# EAGLE design CurrentCost (EAGLE 7.4.0)
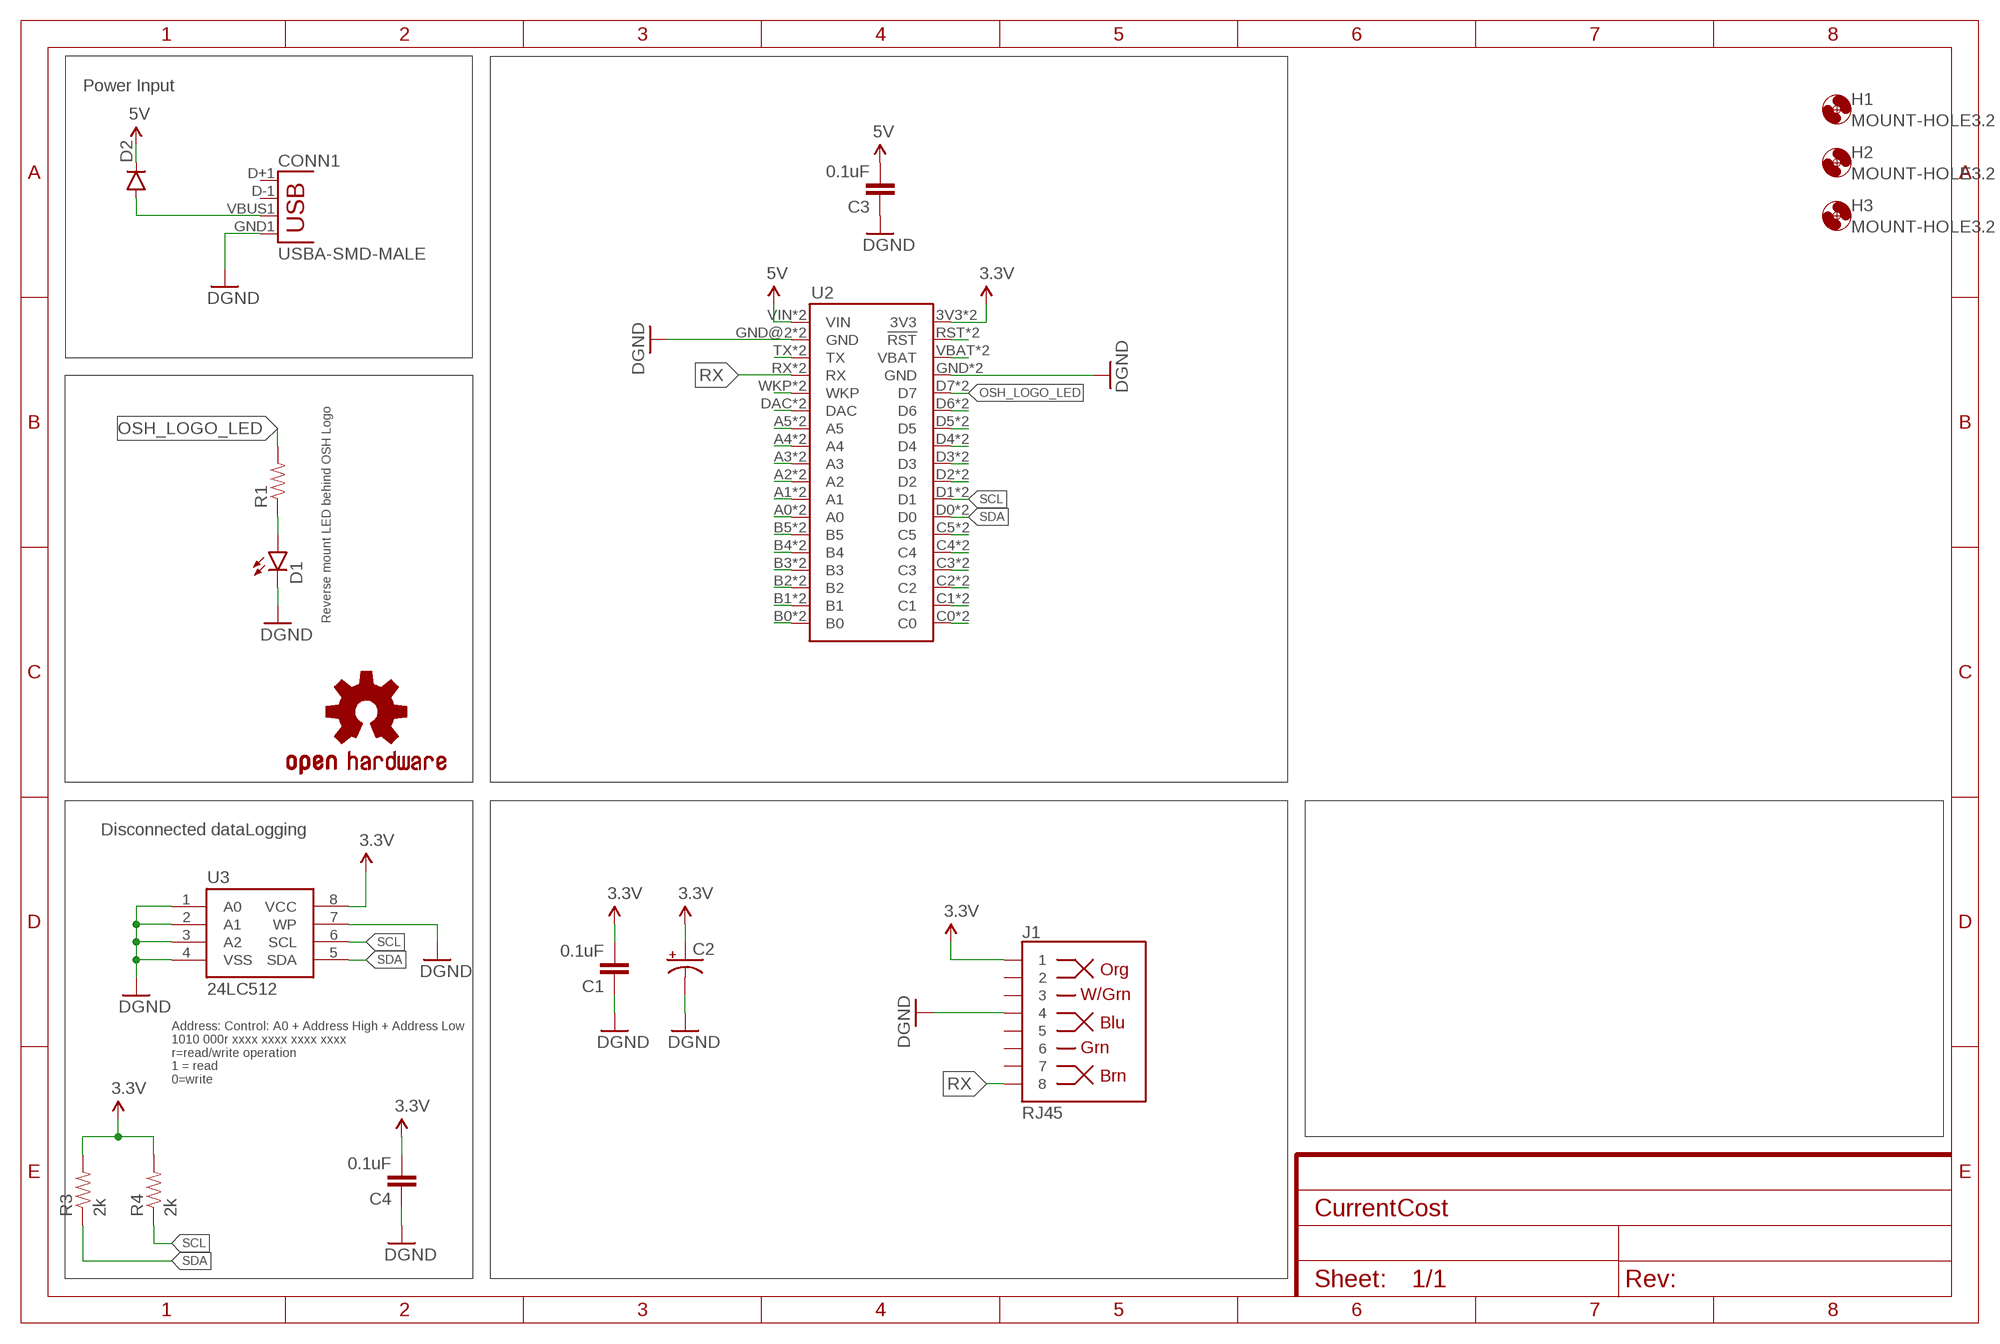
[diagram p0: schematic, sheet 1]

## Parts
C1  0.1uF  CAP0805  [0805]
C2  CAP_POLPTH1  [CPOL-RADIAL-100UF-25V]
C3  0.1uF  CAP0805  [0805]
C4  0.1uF  CAP0805  [0805]
CONN1  USBA-SMD-MALE  [USB-A-SMT-MALE]
D1  LED1206-BOTTOM  [LED-1206-BOTTOM]
D2  DIODESMA  [SMA-DIODE]
H1  MOUNT-HOLE3.2  [3,2]
H2  MOUNT-HOLE3.2  [3,2]
H3  MOUNT-HOLE3.2  [3,2]
J1  RJ45  RJ45-8PTH  [RJ45-8]
LOGO1  OSHW-LOGOM  [OSHW-LOGO-M]
R1  RESISTOR1206  [1206]
R3  2k  RESISTOR0805-RES  [0805]
R4  2k  RESISTOR0805-RES  [0805]
U2  ELECTRONDUALNAMED  [ELECTRON_SIMPLE_SILK_NAMES_DUAL]
U3  24LC512  EEPROM-I2CSMD  [SO08]

## Nets
3.3V: C1.2 C2.1(+) C4.2 J1.1 R3.2 R4.2 U2.3V3 U2.3V3_1(3V3) U3.8(VCC)
5V: C3.2 D2.C U2.VIN U2.VIN_1B(VIN)
DQ: U2.A0 U2.A0_1(A0)
GND: C1.1 C2.2(-) C3.1 C4.1 CONN1.GND1(GND) D1.C J1.4 U2.GND U2.GND@2(GND) U2.GND_1(GND) U2.GND_1B(GND) U3.1(A0) U3.2(A1) U3.3(A2) U3.4(VSS) U3.7(WP) ; supply symbol labelled DGND
MISO: U2.A4 U2.A4_1(A4)
MOSI: U2.A5 U2.A5_1(A5)
N$1: CONN1.VBUS1(VBUS) D2.A
N$3: U2.A1 U2.A1_1(A1)
N$4: U2.D2 U2.D2_1(D2)
N$6: U2.VBAT U2.VBATT_1(VBAT)
N$7: U2.RST(!RST) U2.RST_1(!RST)
N$12: U2.D3 U2.D3_1(D3)
N$15: U2.D6 U2.D6_1(D6)
N$16: U2.D5 U2.D5_1(D5)
N$21: D1.A R1.1
N$22: U2.C1 U2.C1_1(C1)
N$23: U2.C5 U2.C5_1(C5)
N$24: U2.C4 U2.C4_1(C4)
N$25: U2.C3 U2.C3_1(C3)
N$26: U2.C2 U2.C2_1(C2)
N$27: U2.C0 U2.C0_1(C0)
N$28: U2.D4 U2.D4_1(D4)
N$31: U2.B0 U2.B0_1(B0)
N$33: U2.B1 U2.B1_1(B1)
N$35: U2.B2 U2.B2_1(B2)
N$36: U2.B3 U2.B3_1(B3)
N$37: U2.B4 U2.B4_1(B4)
N$38: U2.B5 U2.B5_1(B5)
N$46: U2.WKP U2.WKP_1(WKP)
N$48: U2.TX U2.TX_1(TX)
OSH_LOGO_LED: R1.2 U2.D7 U2.D7_1(D7)
RX: J1.8 U2.RX U2.RX_1(RX)
SCK: U2.A3 U2.A3_1(A3)
SCL: R4.1 U2.D1 U2.D1_1(D1) U3.6(SCL)
SDA: R3.1 U2.D0 U2.D0_1(D0) U3.5(SDA)
SS: U2.A2 U2.A2_1(A2)
VIN_MONITOR: U2.DAC U2.DAC_1(DAC)
Unconnected: CONN1.D+1(D+) CONN1.D-1(D-) J1.2 J1.3 J1.5 J1.6 J1.7

## Notes on the sheet
- Power Input
- Reverse mount LED behind OSH Logo
- Disconnected dataLogging
- Address: Control: A0 + Address High + Address Low
- 1010 000r xxxx xxxx xxxx xxxx
  r=read/write operation
  1 = read
  0=write

## Library data of the parts
C1 C3 C4 = SparkFun-Passives:CAP: Capacitor Standard 0603 ceramic capacitor, and 0.1" leaded capacitor.
C2 = SparkFun-Capacitors:CAP_POL: Capacitor Polarized These are standard SMD and PTH capacitors. Normally 10uF, 47uF, and 100uF in electrolytic and tantalum varieties. Always verify the external diameter of the through hole cap, it varies with capacity, voltage, and manufacturer. The EIA devices should be standard.
CONN1 = SparkFun-Connectors:USB: USB Connectors USB-B-PTH is fully proven SKU : PRT-00139/CONN-08278 USB-miniB is fully proven SKU : PRT-00587 USB-A-PCB is untested. USB-A-H is throughly reviewed, but untested. Spark Fun Electronics SKU : PRT-00437 USB-B-SMT is throughly reviewed, but untested. Needs silkscreen touching up. USB-A-S has not been used/tested USB-MB-H has not been used/tested USB-MICROB has been used. CONN-09505
D1 = SparkFun-LED:LED: LEDs Standard schematic elements and footprints for 5mm, 3mm, 1206, and 0603 sized LEDs. 5mm - Spark Fun Electronics SKU : COM-00529 (and others)
D2 = SparkFun-DiscreteSemi:DIODE: Diode These are standard reverse protection diodes and small signal diodes. SMA package can handle up to about 1A. SOD-323 can handle about 200mA. What the SOD-323 package when ordering, there are some mfgs out there that are 5-pin packages.
H1-H3 = holes:MOUNT-HOLE: MOUNTING HOLE with drill center marker
J1 = SparkFun-Connectors:RJ45-8: RJ45 Jack Simple RJ45, 8-pin connection - connector for common Cat5, Cat5e, and Cat6 Ethernet cables. Footprint not yet proven in production. Connector sku is PRT-00643; Breakout PCB sku is BOB-00716.; FARNELL: 1524544; PROD_ID: CONN-08506
LOGO1 = SparkFun-Aesthetics:OSHW-LOGO: Open Source Hardware Logo This logo indicates the piece of hardware it is found on incorporates a OSHW license and/or adheres to the definition of open source hardware found here: http://freedomdefined.org/OSHW
R1 R3 R4 = SparkFun-Resistors:RESISTOR: Resistor Basic schematic elements and footprints for 0603, 1206, and PTH resistors.
U2 = Tinamous:ELECTRON
U3 = SparkFun-DigitalIC:EEPROM-I2C: I2C EEPROM chips, 24LC256 (and others); FARNELL: 1801220

## Board
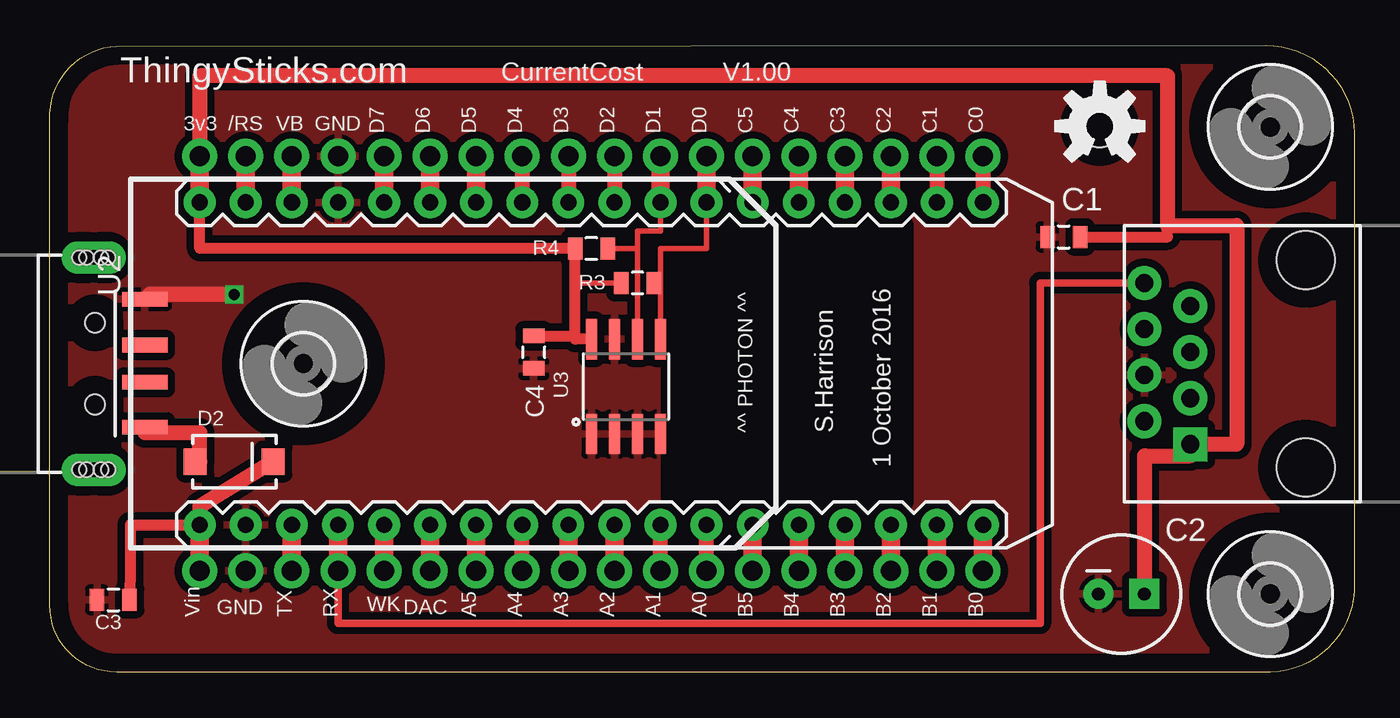
[diagram p1: board, top side]
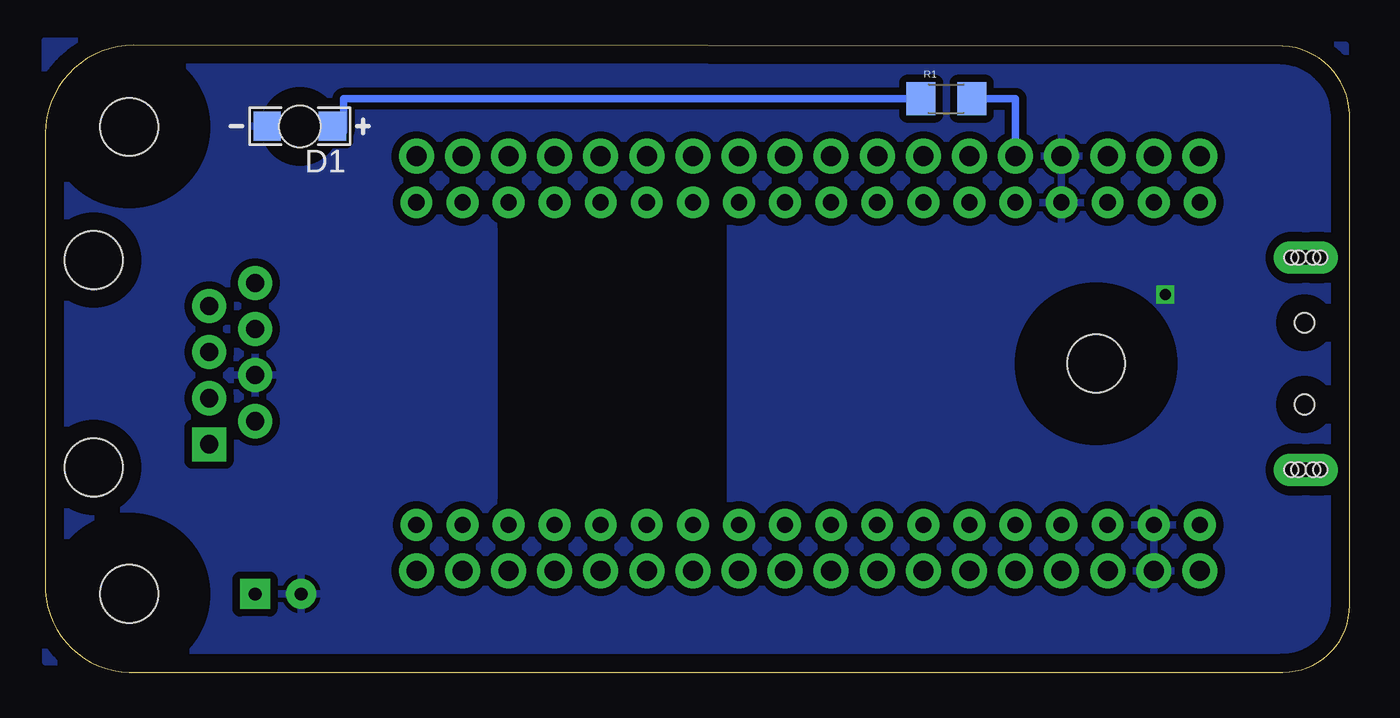
[diagram p2: board, bottom side, seen from below]

Size 71.89 x 34.57 mm. Coordinates in mm from the lower left corner, seen from the top.
Outline: 3.68,34.53 67.01,34.57 arc-90 71.89,29.72 71.89,4.45 arc-90 66.83,0.01 3.68,0.01 arc-90 0,3.68 0,30.47 arc-90 3.68,34.53
Copper layers (1*16): Top 0.035mm / dielectric 1.5mm / Bottom 0.035mm
Design rules "default": minimum track width 10mil, minimum drill 24mil, track to track 8mil, track to pad 8mil, pad to pad 8mil, via to via 8mil, smd to smd 8mil, copper to edge 40mil, drill to drill 8mil, minimum pad ring 10mil, minimum via ring 8mil, stop-mask expansion 4mil, vias tented up to drill 0mil, thermal gap 10mil
tRestrict: area 34.3,6.9 to 47,27.2
bRestrict: area 34.9,6.9 to 46.4,27.2

### Footprints (pad centres in the part's own frame; a part is rotated, then mirrored left to right if it is on the bottom)
0805 = smd 0.8 x 1.2: 1 -0.9,0; 2 0.9,0
CPOL-RADIAL-100UF-25V = drill 0.7 pad 1.651 square: 1 1.27,0 | drill 0.7 pad 1.651: 2 -1.27,0
USB-A-SMT-MALE = smd 0.8 x 2.5: D+1 1.027,-5.87; D-1 -1.027,-5.87; GND1 3.551,-5.87; VBUS1 -3.5,-5.87 | drill 0.8 pad 1.778 long: P$1 5.85,-3.05; P$3 -5.85,-3.05 | hole 1.1: 2.25,-3.12; -2.25,-3.12 | hole 0.8: -5.85,-3.45; -5.85,-3.85; -5.85,-2.65; -5.85,-2.25; 5.85,-3.45; 5.85,-3.85; 5.85,-2.65; 5.85,-2.25
LED-1206-BOTTOM = smd 1.5 x 1.6: A -1.8,0; C 1.8,0 | hole 2.3: 0,0
SMA-DIODE = smd 1.27 x 1.47: A -2.15,0; C 2.15,0
3,2 = hole 3.2: 0,0
RJ45-8 = drill 1 pad 1.88 square: 1 -4.445,6.35 | drill 1 pad 1.88: 2 -3.175,8.89; 3 -1.905,6.35; 4 -0.635,8.89; 5 0.635,6.35; 6 1.905,8.89; 7 3.175,6.35; 8 4.445,8.89 | hole 3.2: -5.715,0; 5.715,0
1206 = smd 1.6 x 1.8: 1 -1.4,0; 2 1.4,0
ELECTRON_SIMPLE_SILK_NAMES_DUAL = drill 0.889 pad 1.753: 3V3 1.27,22.86; A0 29.21,5.08; A1 26.67,5.08; A2 24.13,5.08; A3 21.59,5.08; A4 19.05,5.08; A5 16.51,5.08; B0 44.45,5.08; B1 41.91,5.08; B2 39.37,5.08; B3 36.83,5.08; B4 34.29,5.08; B5 31.75,5.08; C0 44.45,22.86; C1 41.91,22.86; C2 39.37,22.86; C3 36.83,22.86; C4 34.29,22.86; C5 31.75,22.86; D0 29.21,22.86; D1 26.67,22.86; D2 24.13,22.86; D3 21.59,22.86; D4 19.05,22.86; D5 16.51,22.86; D6 13.97,22.86; D7 11.43,22.86; DAC 13.97,5.08; GND 8.89,22.86; GND@2 3.81,5.08; RST 3.81,22.86; RX 8.89,5.08; TX 6.35,5.08; VBAT 6.35,22.86; VIN 1.27,5.08; WKP 11.43,5.08 | drill 1.1 pad 1.93: 3V3_1 1.27,25.4; A0_1 29.21,2.54; A1_1 26.67,2.54; A2_1 24.13,2.54; A3_1 21.59,2.54; A4_1 19.05,2.54; A5_1 16.51,2.54; B0_1 44.45,2.54; B1_1 41.91,2.54; B2_1 39.37,2.54; B3_1 36.83,2.54; B4_1 34.29,2.54; B5_1 31.75,2.54; C0_1 44.45,25.4; C1_1 41.91,25.4; C2_1 39.37,25.4; C3_1 36.83,25.4; C4_1 34.29,25.4; C5_1 31.75,25.4; D0_1 29.21,25.4; D1_1 26.67,25.4; D2_1 24.13,25.4; D3_1 21.59,25.4; D4_1 19.05,25.4; D5_1 16.51,25.4; D6_1 13.97,25.4; D7_1 11.43,25.4; DAC_1 13.97,2.54; GND_1 8.89,25.4; GND_1B 3.81,2.54; RST_1 3.81,25.4; RX_1 8.89,2.54; TX_1 6.35,2.54; VBATT_1 6.35,25.4; VIN_1B 1.27,2.54; WKP_1 11.43,2.54
SO08 = smd 0.61 x 2.21: 1 -1.905,-2.616; 2 -0.635,-2.616; 3 0.635,-2.616; 4 1.905,-2.616; 5 1.905,2.616; 6 0.635,2.616; 7 -0.635,2.616; 8 -1.905,2.616

### Placement (x,y rotation side)
C1  55.88,24 0 top
C2  59.06,4.32 0 top
C3  3.49,4 0 top
C4  26.67,17.65 90 top
CONN1  -0.63,17.02 90 top
D1  57.87,30.1 180 bottom
D2  10.16,11.62 0 top
H1  13.97,17.02 0 top
H2  67.26,4.32 0 top
H3  67.26,30.07 0 top
J1  69.22,17.02 90 top
LOGO1  57.87,30.1 0 top
R1  22.23,31.62 0 bottom
R3  32.39,21.46 180 top
R4  29.85,23.37 180 top
U2  6.99,3.05 0 top
U3  31.75,15.75 0 top

### Tracks (layer width: path | path; a pad name or v marks a point on that pad's centre or on a via)
3.3V
  Top 0.305: R3.2 28.95,21.46 R4.2
  Top 0.61: U2.3V3 8.26,23.37 R4.2 28.95,18.55 | U3.8 28.95,18.36 28.95,18.55 | C4.2 28.95,18.55 | C1.2 61.6,24 61.6,24.64
  Top 0.813: U2.3V3_1 8.26,32.89 61.6,32.89 61.6,24.64 65.41,24.64 65.41,12.57 J1.1 62.87,11.94 60.33,11.94 C2.1
  Top 1.016: U2.3V3 U2.3V3_1
5V
  Top 0.61: C3.2 4.45,5.27 4.45,8.13 U2.VIN
  Top 0.813: U2.VIN_1B 8.26,9.15 D2.C
  Top 1.016: U2.VIN_1B U2.VIN
DQ
  Top 0.813: U2.A0_1 U2.A0
GND  (via drill 0.6)
  Top 0.813: v10.16,20.83 5.5,20.83 CONN1.GND1
  pour Bottom (isolate 0.406, rank 6): 0.25,34.58 71.89,34.83 71.86,0.59 1.86,0.52 0.4,0.52
  pour Top (isolate 0.406, rank 6): -0.63,35.43 72.27,35.3 72.34,0.44 -0.63,0.51
MISO
  Top 0.813: U2.A4_1 U2.A4
MOSI
  Top 1.016: U2.A5 U2.A5_1
N$1
  Top 0.813: 5.71,13.52 CONN1.VBUS1 5.24,13.21 8.26,13.21 8.26,11.62 D2.A
N$3
  Top 0.813: U2.A1_1 U2.A1
N$4
  Top 0.813: U2.D2_1 U2.D2
N$6
  Top 1.016: U2.VBAT U2.VBATT_1
N$7
  Top 1.016: U2.RST U2.RST_1
N$12
  Top 0.813: U2.D3_1 U2.D3
N$15
  Top 1.016: U2.D6 U2.D6_1
N$16
  Top 1.016: U2.D5 U2.D5_1
N$21
  Bottom 0.406: R1.1 55.45,31.62 55.45,29.82 56.07,29.82 D1.A
N$22
  Top 0.813: U2.C1_1 U2.C1
N$23
  Top 1.016: U2.C5_1 U2.C5
N$24
  Top 1.016: U2.C4_1 U2.C4
N$25
  Top 1.016: U2.C3_1 U2.C3
N$26
  Top 1.016: U2.C2_1 U2.C2
N$27
  Top 0.813: U2.C0_1 U2.C0
N$28
  Top 0.813: U2.D4_1 U2.D4
N$31
  Top 1.016: U2.B0_1 U2.B0
N$33
  Top 1.016: U2.B1 U2.B1_1
N$35
  Top 1.016: U2.B2_1 U2.B2
N$36
  Top 1.016: U2.B3 U2.B3_1
N$37
  Top 1.016: U2.B4_1 U2.B4
N$38
  Top 1.016: U2.B5 U2.B5_1
N$46
  Top 1.016: U2.WKP U2.WKP_1
N$48
  Top 1.016: U2.TX U2.TX_1
OSH_LOGO_LED
  Top 1.016: U2.D7 U2.D7_1
  Bottom 0.406: R1.2 18.42,31.62 U2.D7_1
RX
  Top 0.406: J1.8 54.59,21.46 54.59,2.7 15.88,2.7 U2.RX_1
  Top 1.016: U2.RX_1 U2.RX
SCK
  Top 1.016: U2.A3 U2.A3_1
SCL
  Top 0.305: 32.39,18.92 32.39,23.37 | 32.39,23.37 32.39,24.32 33.66,24.32 U2.D1 | R4.1 32.39,23.37
  Top 0.406: U3.6 32.39,18.92
  Top 1.016: U2.D1 U2.D1_1
SDA
  Top 0.305: U2.D0 36.2,23.37 33.66,23.37 33.66,21.46 | U3.5 33.66,21.46 | R3.1 33.66,21.46
  Top 1.016: U2.D0_1 U2.D0
SS
  Top 1.016: U2.A2_1 U2.A2
VIN_MONITOR
  Top 1.016: U2.DAC_1 U2.DAC

### Text on the board
tNames: ThingySticks.com | CurrentCost | V1.00 | ^^ PHOTON ^^ | S.Harrison | 1 October 2016